# EAGLE design 2010_06_16_a_matriLedWatch (EAGLE 4.16)

## Sheet 1 of 2
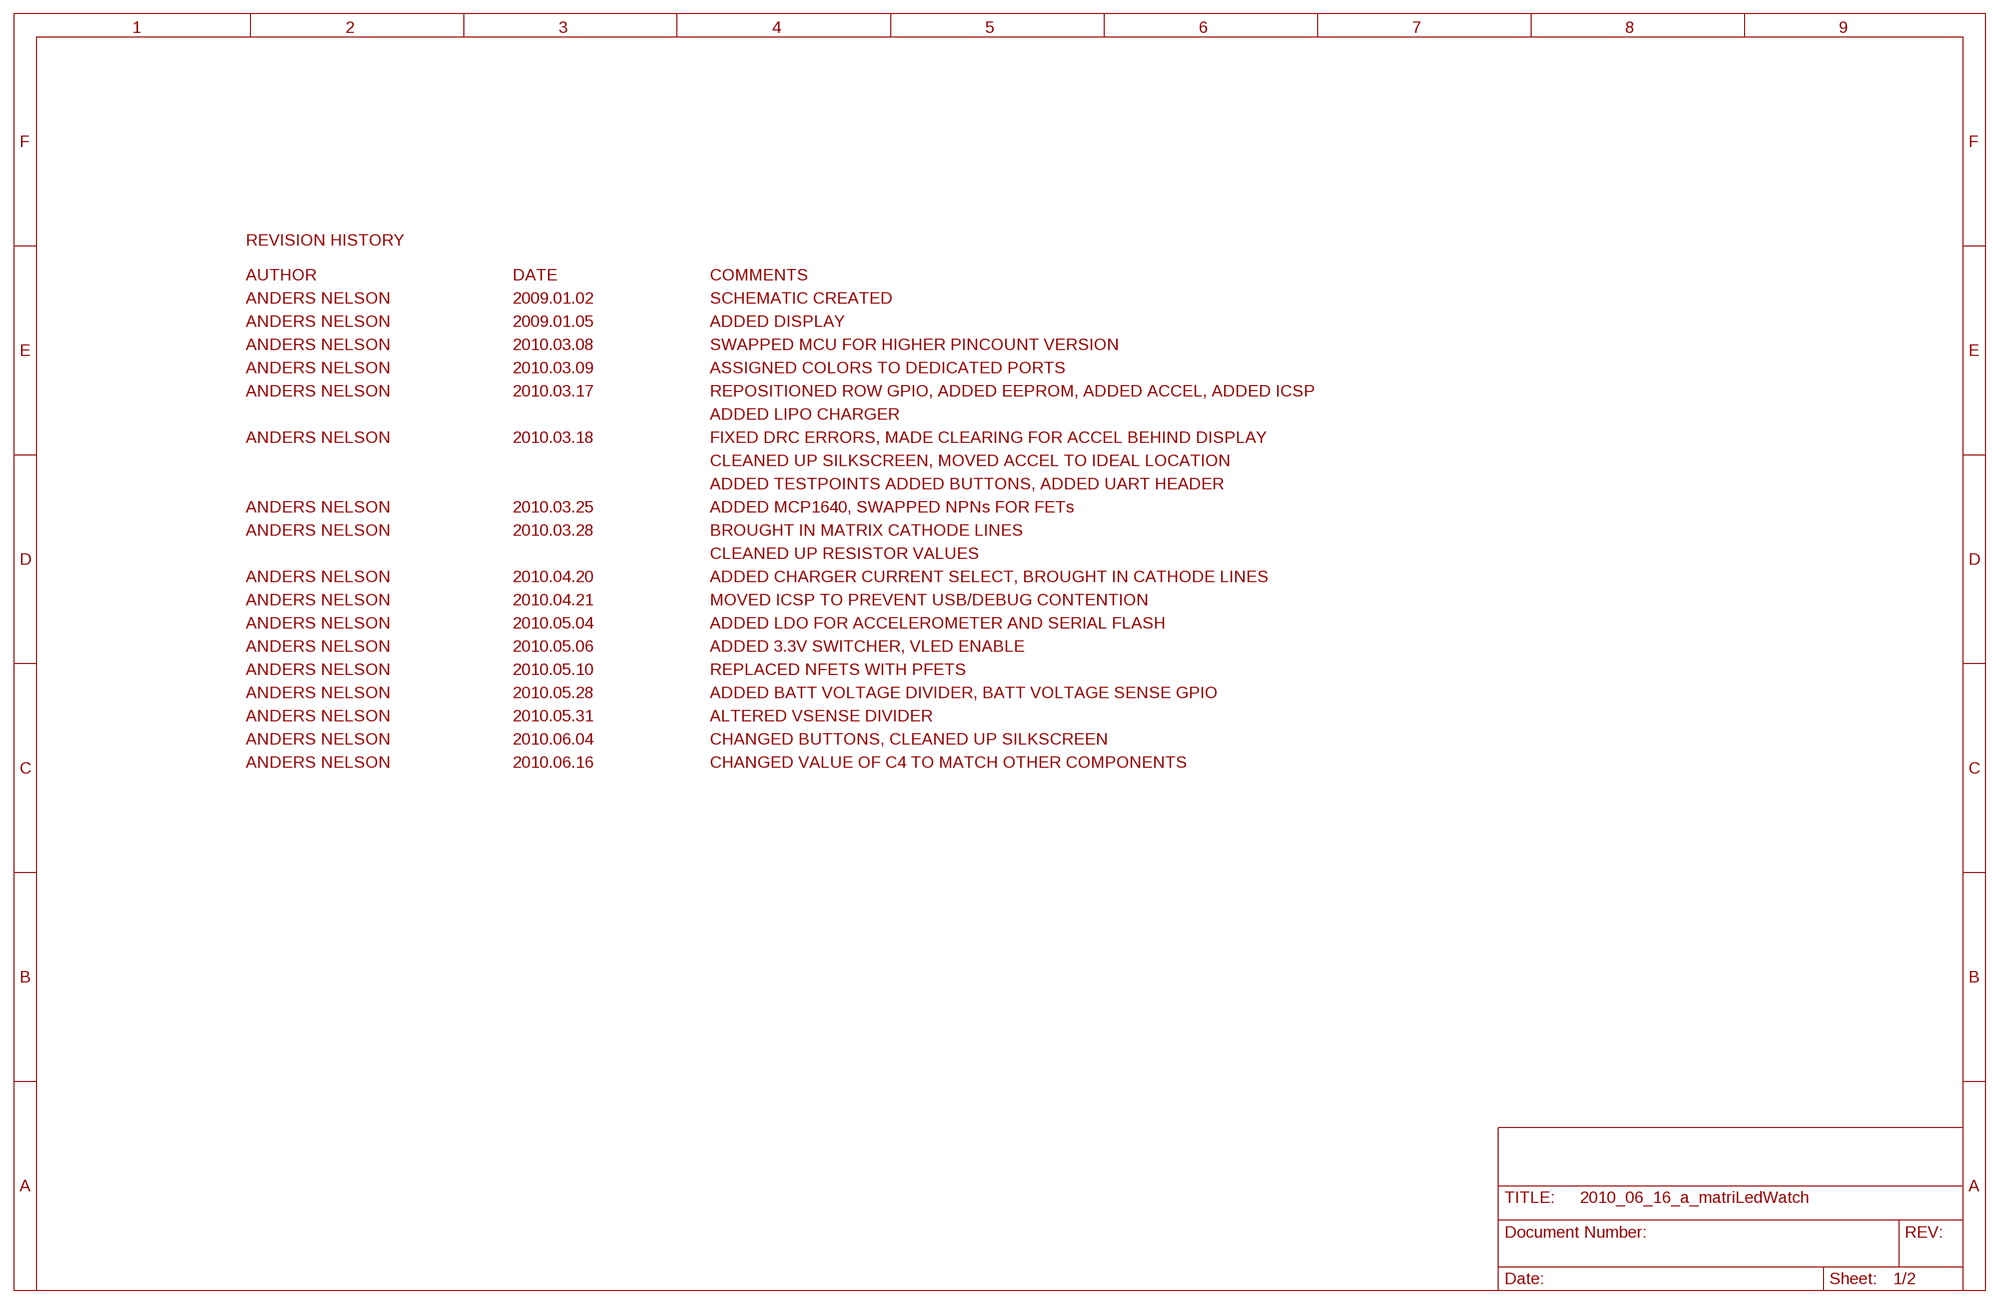
[diagram p0: schematic, sheet 1]

### Notes on the sheet
- REVISION HISTORY
- AUTHOR | DATE | COMMENTS
- ANDERS NELSON | 2009.01.02 | SCHEMATIC CREATED
- ANDERS NELSON | 2009.01.05 | ADDED DISPLAY
- ANDERS NELSON | 2010.03.08 | SWAPPED MCU FOR HIGHER PINCOUNT VERSION
- ANDERS NELSON | 2010.03.09 | ASSIGNED COLORS TO DEDICATED PORTS
- ANDERS NELSON | 2010.03.17 | REPOSITIONED ROW GPIO, ADDED EEPROM, ADDED ACCEL, ADDED ICSP
- ADDED LIPO CHARGER
- ANDERS NELSON | 2010.03.18 | FIXED DRC ERRORS, MADE CLEARING FOR ACCEL BEHIND DISPLAY
- CLEANED UP SILKSCREEN, MOVED ACCEL TO IDEAL LOCATION
- ADDED TESTPOINTS ADDED BUTTONS, ADDED UART HEADER
- ANDERS NELSON | 2010.03.25 | ADDED MCP1640, SWAPPED NPNs FOR FETs
- ANDERS NELSON | 2010.03.28 | BROUGHT IN MATRIX CATHODE LINES
- CLEANED UP RESISTOR VALUES
- ANDERS NELSON | 2010.04.20 | ADDED CHARGER CURRENT SELECT, BROUGHT IN CATHODE LINES
- ANDERS NELSON | 2010.04.21 | MOVED ICSP TO PREVENT USB/DEBUG CONTENTION
- ANDERS NELSON | 2010.05.04 | ADDED LDO FOR ACCELEROMETER AND SERIAL FLASH
- ANDERS NELSON | 2010.05.06 | ADDED 3.3V SWITCHER, VLED ENABLE
- ANDERS NELSON | 2010.05.10 | REPLACED NFETS WITH PFETS
- ANDERS NELSON | 2010.05.28 | ADDED BATT VOLTAGE DIVIDER, BATT VOLTAGE SENSE GPIO
- ANDERS NELSON | 2010.05.31 | ALTERED VSENSE DIVIDER
- ANDERS NELSON | 2010.06.04 | CHANGED BUTTONS, CLEANED UP SILKSCREEN
- ANDERS NELSON | 2010.06.16 | CHANGED VALUE OF C4 TO MATCH OTHER COMPONENTS

## Sheet 2 of 2
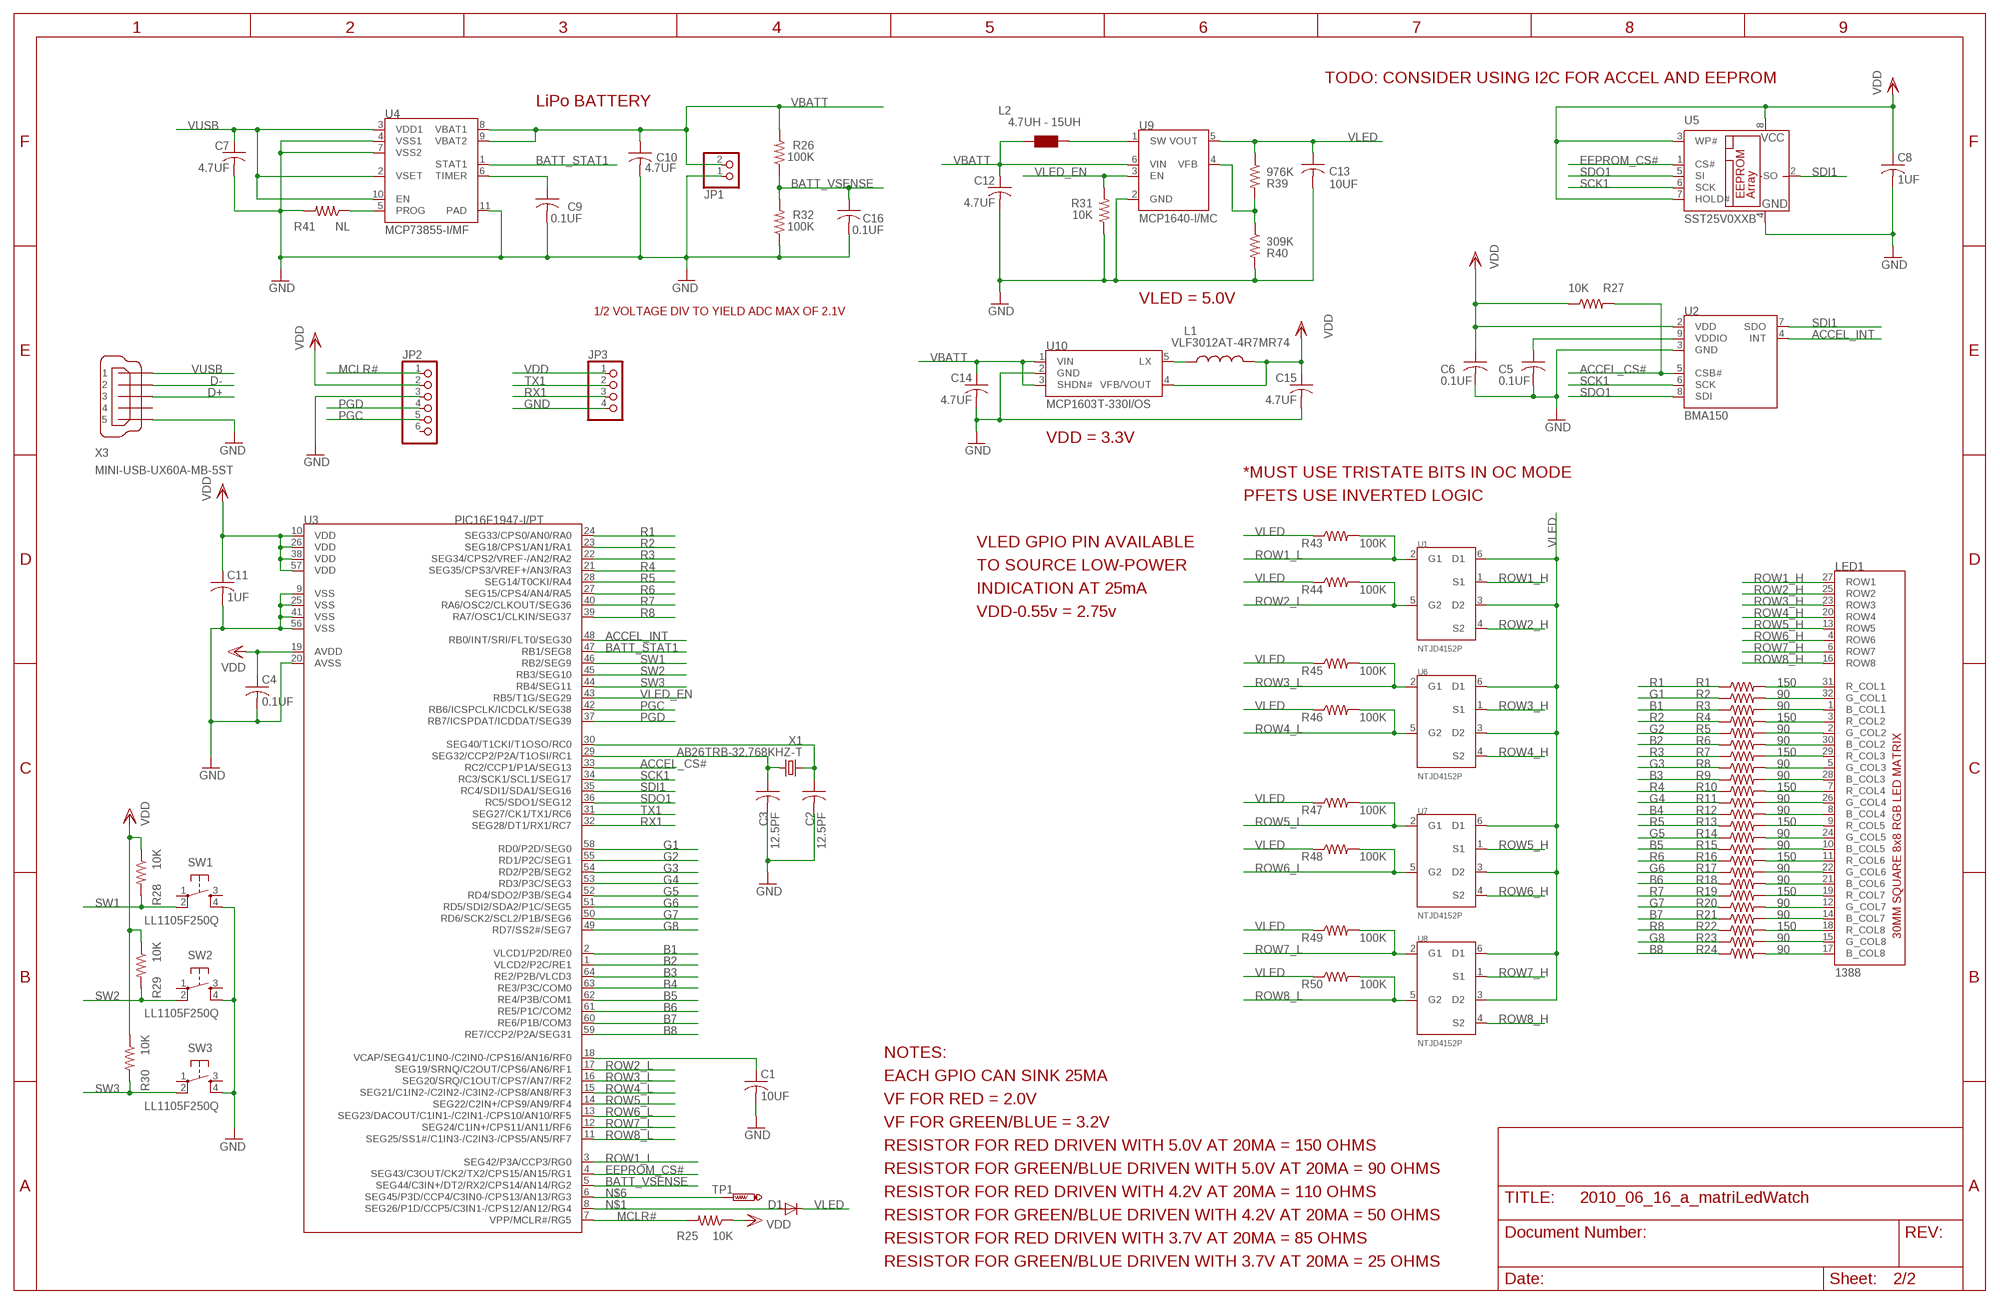
[diagram p1: schematic, sheet 2]

### Parts
C1  10UF  C-USC0603  [C0603]
C2  12.5PF  C-USC0603  [C0603]
C3  12.5PF  C-USC0603  [C0603]
C4  0.1UF  C-USC0603  [C0603]
C5  0.1UF  C-USC0603  [C0603]
C6  0.1UF  C-USC0603  [C0603]
C7  4.7UF  C-USC0603  [C0603]
C8  1UF  C-USC0603  [C0603]
C9  0.1UF  C-USC0603  [C0603]
C10  4.7UF  C-USC0603  [C0603]
C11  1UF  C-USC0603  [C0603]
C12  4.7UF  C-USC0603  [C0603]
C13  10UF  C-USC0603  [C0603]
C14  4.7UF  C-USC0603  [C0603]
C15  4.7UF  C-USC0603  [C0603]
C16  0.1UF  C-USC0603  [C0603]
D1  DIODE-SOD323-R  [SOD323-R]
JP1  PINHD-1X2  [1X02]
JP2  PINHD-1X6  [1X06]
JP3  PINHD-1X4  [1X04]
L1  VLF3012AT-4R7MR74  [VLF3012A]
L2  4.7UH - 15UH  WE-TPC_S  [WE-TPC_S]
LED1  1388  [1388]
R1  150  R-US_R0402  [R0402]
R2  90  R-US_R0402  [R0402]
R3  90  R-US_R0402  [R0402]
R4  150  R-US_R0402  [R0402]
R5  90  R-US_R0402  [R0402]
R6  90  R-US_R0402  [R0402]
R7  150  R-US_R0402  [R0402]
R8  90  R-US_R0402  [R0402]
R9  90  R-US_R0402  [R0402]
R10  150  R-US_R0402  [R0402]
R11  90  R-US_R0402  [R0402]
R12  90  R-US_R0402  [R0402]
R13  150  R-US_R0402  [R0402]
R14  90  R-US_R0402  [R0402]
R15  90  R-US_R0402  [R0402]
R16  150  R-US_R0402  [R0402]
R17  90  R-US_R0402  [R0402]
R18  90  R-US_R0402  [R0402]
R19  150  R-US_R0402  [R0402]
R20  90  R-US_R0402  [R0402]
R21  90  R-US_R0402  [R0402]
R22  150  R-US_R0402  [R0402]
R23  90  R-US_R0402  [R0402]
R24  90  R-US_R0402  [R0402]
R25  10K  R-US_R0603  [R0603]
R26  100K  R-US_R0603  [R0603]
R27  10K  R-US_R0603  [R0603]
R28  10K  R-US_R0603  [R0603]
R29  10K  R-US_R0603  [R0603]
R30  10K  R-US_R0603  [R0603]
R31  10K  R-US_R0603  [R0603]
R32  100K  R-US_R0603  [R0603]
R39  976K  R-US_R0603  [R0603]
R40  309K  R-US_R0603  [R0603]
R41  NL  R-US_R0603  [R0603]
R43  100K  R-US_R0402  [R0402]
R44  100K  R-US_R0402  [R0402]
R45  100K  R-US_R0402  [R0402]
R46  100K  R-US_R0402  [R0402]
R47  100K  R-US_R0402  [R0402]
R48  100K  R-US_R0402  [R0402]
R49  100K  R-US_R0402  [R0402]
R50  100K  R-US_R0402  [R0402]
SW1  LL1105F250Q  [LL1105]
SW2  LL1105F250Q  [LL1105]
SW3  LL1105F250Q  [LL1105]
TP1  PTR1B1,27  [B1,27]
U1  NTJD4152P  [SOT363_PHILIPS]
U2  BMA150  [LGA_3X3]
U3  PIC16F1947-I/PT  [TQFP64-10X10]
U4  MCP73855-I/MF  [DFN10_3X3MC]
U5  SST25V0XXB  [SO-08M]
U6  NTJD4152P  [SOT363_PHILIPS]
U7  NTJD4152P  [SOT363_PHILIPS]
U8  NTJD4152P  [SOT363_PHILIPS]
U9  MCP1640-I/MC  [SOT23-6L]
U10  MCP1603T-330I/OS  [SOT23-5L]
X1  AB26TRB-32.768KHZ-T  [CYL_6MM_2MM_SMD]
X3  MINI-USB-UX60A-MB-5ST  [UX60A-MB-5ST]

### Nets
ACCEL_CS#: R27.2 U2.5(CSB#) U3.33(RC2/CCP1/P1A/SEG13)
ACCEL_INT: U2.4(INT) U3.48(RB0/INT/SRI/FLT0/SEG30)
B1: R3.1 U3.2(VLCD1/P2D/RE0)
B2: R6.1 U3.1(VLCD2/P2C/RE1)
B3: R9.1 U3.64(RE2/P2B/VLCD3)
B4: R12.1 U3.63(RE3/P3C/COM0)
B5: R15.1 U3.62(RE4/P3B/COM1)
B6: R18.1 U3.61(RE5/P1C/COM2)
B7: R21.1 U3.60(RE6/P1B/COM3)
B8: R24.1 U3.59(RE7/CCP2/P2A/SEG31)
BATT_STAT1: U3.47(RB1/SEG8) U4.1(STAT1)
BATT_VSENSE: C16.1 R26.1 R32.2 U3.5(SEG44/C3IN+/DT2/RX2/CPS14/AN14/RG2)
D+: X3.3
D-: X3.2
EEPROM_CS#: U3.4(SEG43/C3OUT/CK2/TX2/CPS15/AN15/RG1) U5.1(CS#)
G1: R2.1 U3.58(RD0/P2D/SEG0)
G2: R5.1 U3.55(RD1/P2C/SEG1)
G3: R8.1 U3.54(RD2/P2B/SEG2)
G4: R11.1 U3.53(RD3/P3C/SEG3)
G5: R14.1 U3.52(RD4/SDO2/P3B/SEG4)
G6: R17.1 U3.51(RD5/SDI2/SDA2/P1C/SEG5)
G7: R20.1 U3.50(RD6/SCK2/SCL2/P1B/SEG6)
G8: R23.1 U3.49(RD7/SS2#/SEG7)
GND: C1.2 C2.2 C3.2 C4.2 C5.2 C6.2 C7.2 C8.2 C9.2 C10.2 C11.2 C12.2 C13.2 C14.2 C15.2 C16.2 JP1.1 JP2.3 JP3.4 R31.1 R32.1 R40.2 R41.2 SW1.4(S1) SW2.4(S1) SW3.4(S1) U2.3(GND) U3.9(VSS) U3.20(AVSS) U3.25(VSS) U3.41(VSS) U3.56(VSS) U4.4(VSS1) U4.7(VSS2) U4.11(PAD) U5.4(GND) U9.2(GND) U10.2(GND) X3.5
MCLR#: JP2.1 R25.2 U3.7(VPP/MCLR#/RG5)
N$1: D1.A U3.8(SEG26/P1D/CCP5/C3IN1-/CPS12/AN12/RG4)
N$2: L2.1 U9.1(SW)
N$3: R41.1 U4.5(PROG)
N$4: R39.2 R40.1 U9.4(VFB)
N$5: L1.P$1 U10.5(LX)
N$6: TP1.PP(TP) U3.6(SEG45/P3D/CCP4/C3IN0-/CPS13/AN13/RG3)
N$9: LED1.31(R_COL1) R1.2
N$10: LED1.32(G_COL1) R2.2
N$11: LED1.1(B_COL1) R3.2
N$12: LED1.3(R_COL2) R4.2
N$13: LED1.2(G_COL2) R5.2
N$14: LED1.30(B_COL2) R6.2
N$15: LED1.29(R_COL3) R7.2
N$16: LED1.5(G_COL3) R8.2
N$17: LED1.28(B_COL3) R9.2
N$18: LED1.7(R_COL4) R10.2
N$19: LED1.26(G_COL4) R11.2
N$20: LED1.8(B_COL4) R12.2
N$21: LED1.9(R_COL5) R13.2
N$22: LED1.24(G_COL5) R14.2
N$23: LED1.10(B_COL5) R15.2
N$24: LED1.11(R_COL6) R16.2
N$25: LED1.22(G_COL6) R17.2
N$26: LED1.21(B_COL6) R18.2
N$27: LED1.19(R_COL7) R19.2
N$28: LED1.12(G_COL7) R20.2
N$29: LED1.14(B_COL7) R21.2
N$30: LED1.18(R_COL8) R22.2
N$31: LED1.15(G_COL8) R23.2
N$32: LED1.17(B_COL8) R24.2
N$36: C9.1 U4.6(TIMER)
N$42: C5.1 U2.9(VDDIO)
N$65: C1.1 U3.18(VCAP/SEG41/C1IN0-/C2IN0-/CPS16/AN16/RF0)
N$67: C3.1 U3.29(SEG32/CCP2/P2A/T1OSI/RC1) X1.3
N$68: C2.1 U3.30(SEG40/T1CKI/T1OSO/RC0) X1.2
PGC: JP2.5 U3.42(RB6/ICSPCLK/ICDCLK/SEG38)
PGD: JP2.4 U3.37(RB7/ICSPDAT/ICDDAT/SEG39)
R1: R1.1 U3.24(SEG33/CPS0/AN0/RA0)
R2: R4.1 U3.23(SEG18/CPS1/AN1/RA1)
R3: R7.1 U3.22(SEG34/CPS2/VREF-/AN2/RA2)
R4: R10.1 U3.21(SEG35/CPS3/VREF+/AN3/RA3)
R5: R13.1 U3.28(SEG14/T0CKI/RA4)
R6: R16.1 U3.27(SEG15/CPS4/AN4/RA5)
R7: R19.1 U3.40(RA6/OSC2/CLKOUT/SEG36)
R8: R22.1 U3.39(RA7/OSC1/CLKIN/SEG37)
ROW1_H: LED1.27(ROW1) U1.1(S1)
ROW1_L: R43.2 U1.2(G1) U3.3(SEG42/P3A/CCP3/RG0)
ROW2_H: LED1.25(ROW2) U1.4(S2)
ROW2_L: R44.2 U1.5(G2) U3.17(SEG19/SRNQ/C2OUT/CPS6/AN6/RF1)
ROW3_H: LED1.23(ROW3) U6.1(S1)
ROW3_L: R45.2 U3.16(SEG20/SRQ/C1OUT/CPS7/AN7/RF2) U6.2(G1)
ROW4_H: LED1.20(ROW4) U6.4(S2)
ROW4_L: R46.2 U3.15(SEG21/C1IN2-/C2IN2-/C3IN2-/CPS8/AN8/RF3) U6.5(G2)
ROW5_H: LED1.13(ROW5) U7.1(S1)
ROW5_L: R47.2 U3.14(SEG22/C2IN+/CPS9/AN9/RF4) U7.2(G1)
ROW6_H: LED1.4(ROW6) U7.4(S2)
ROW6_L: R48.2 U3.13(SEG23/DACOUT/C1IN1-/C2IN1-/CPS10/AN10/RF5) U7.5(G2)
ROW7_H: LED1.6(ROW7) U8.1(S1)
ROW7_L: R49.2 U3.12(SEG24/C1IN+/CPS11/AN11/RF6) U8.2(G1)
ROW8_H: LED1.16(ROW8) U8.4(S2)
ROW8_L: R50.2 U3.11(SEG25/SS1#/C1IN3-/C2IN3-/CPS5/AN5/RF7) U8.5(G2)
RX1: JP3.3 U3.32(SEG28/DT1/RX1/RC7)
SCK1: U2.6(SCK) U3.34(RC3/SCK1/SCL1/SEG17) U5.6(SCK)
SDI1: U2.7(SDO) U3.35(RC4/SDI1/SDA1/SEG16) U5.2(SO)
SDO1: U2.8(SDI) U3.36(RC5/SDO1/SEG12) U5.5(SI)
SW1: R28.2 SW1.2(P1) U3.46(RB2/SEG9)
SW2: R29.2 SW2.2(P1) U3.45(RB3/SEG10)
SW3: R30.2 SW3.2(P1) U3.44(RB4/SEG11)
TX1: JP3.2 U3.31(SEG27/CK1/TX1/RC6)
VBATT: C10.1 C12.1 C14.1 JP1.2 L2.2 R26.2 U4.8(VBAT1) U4.9(VBAT2) U9.6(VIN) U10.1(VIN) U10.3(SHDN#)
VDD: C4.1 C6.1 C8.1 C11.1 C15.1 JP2.2 JP3.1 L1.P$2 R25.1 R27.1 R28.1 R29.1 R30.1 U2.2(VDD) U3.10(VDD) U3.19(AVDD) U3.26(VDD) U3.38(VDD) U3.57(VDD) U5.3(WP#) U5.7(HOLD#) U5.8(VCC) U10.4(VFB/VOUT)
VLED: C13.1 D1.C R39.1 R43.1 R44.1 R45.1 R46.1 R47.1 R48.1 R49.1 R50.1 U1.3(D2) U1.6(D1) U6.3(D2) U6.6(D1) U7.3(D2) U7.6(D1) U8.3(D2) U8.6(D1) U9.5(VOUT)
VLED_EN: R31.2 U3.43(RB5/T1G/SEG29) U9.3(EN)
VUSB: C7.1 U4.2(VSET) U4.3(VDD1) U4.10(EN) X3.1
Unconnected: JP2.6 SW1.1(P) SW1.3(S) SW2.1(P) SW2.3(S) SW3.1(P) SW3.3(S) X3.4

### Notes on the sheet
- TODO: CONSIDER USING I2C FOR ACCEL AND EEPROM
- LiPo BATTERY
- VLED = 5.0V
- 1/2 VOLTAGE DIV TO YIELD ADC MAX OF 2.1V
- VDD = 3.3V
- *MUST USE TRISTATE BITS IN OC MODE
- PFETS USE INVERTED LOGIC
- VLED GPIO PIN AVAILABLE
- TO SOURCE LOW-POWER
- INDICATION AT 25mA
- VDD-0.55v = 2.75v
- NOTES:
- EACH GPIO CAN SINK 25MA
- VF FOR RED = 2.0V
- VF FOR GREEN/BLUE = 3.2V
- RESISTOR FOR RED DRIVEN WITH 5.0V AT 20MA = 150 OHMS
- RESISTOR FOR GREEN/BLUE DRIVEN WITH 5.0V AT 20MA = 90 OHMS
- RESISTOR FOR RED DRIVEN WITH 4.2V AT 20MA = 110 OHMS
- RESISTOR FOR GREEN/BLUE DRIVEN WITH 4.2V AT 20MA = 50 OHMS
- RESISTOR FOR RED DRIVEN WITH 3.7V AT 20MA = 85 OHMS
- RESISTOR FOR GREEN/BLUE DRIVEN WITH 3.7V AT 20MA = 25 OHMS

## Library data of the parts
C1-C16 = rcl:C-US: CAPACITOR, American symbol
D1 = diode:DIODE-: DIODE
JP1 = pinhead:PINHD-1X2: PIN HEADER
JP2 = pinhead:PINHD-1X6: PIN HEADER
JP3 = pinhead:PINHD-1X4: PIN HEADER
L1 = matriLedWatch:VLF3012AT*
L2 = wuerth-elektronik:WE-TPC: Shielded Tiny Power Inductor WE-TPC - Extremely flat power inductor - High current capability - High reliability and perfect soldering characteristics because of integrated soldering pad - magnetically shielded -- Portable power like PDA, digital camera, PCMICA-cards and displays -- DC/DC-converter -- Recommended for switching regulator IC's from Linear Technology, National Semiconductor, Texas Instruments and Fairchild Semiconductor
LED1 = matriLedWatch:1388
R1-R32 R39-R41 R43-R50 = rcl:R-US_: RESISTOR, American symbol
SW1-SW3 = raveGearControl:LL1105*
TP1 = testpad:PTR1: TEST PIN
U1 U6-U8 = matriLedWatch:NTJD4152P
U2 = Bosch:BMA150
U3 = matriLedWatch:PIC16F194*
U4 = matriLedWatch:MCP73855
U5 = raveGearControl:SST25V0XXB
U9 = matriLedWatch:MCP1640*
U10 = matriLedWatch:MCP1603*
X1 = raveGearControl2:AB26TRB-32.768KHZ-T
X3 = con-hirose:MINI-USB-: MINI USB Connector Source: http://www.hirose.co.jp/cataloge_hp/e24000019.pdf

## Board
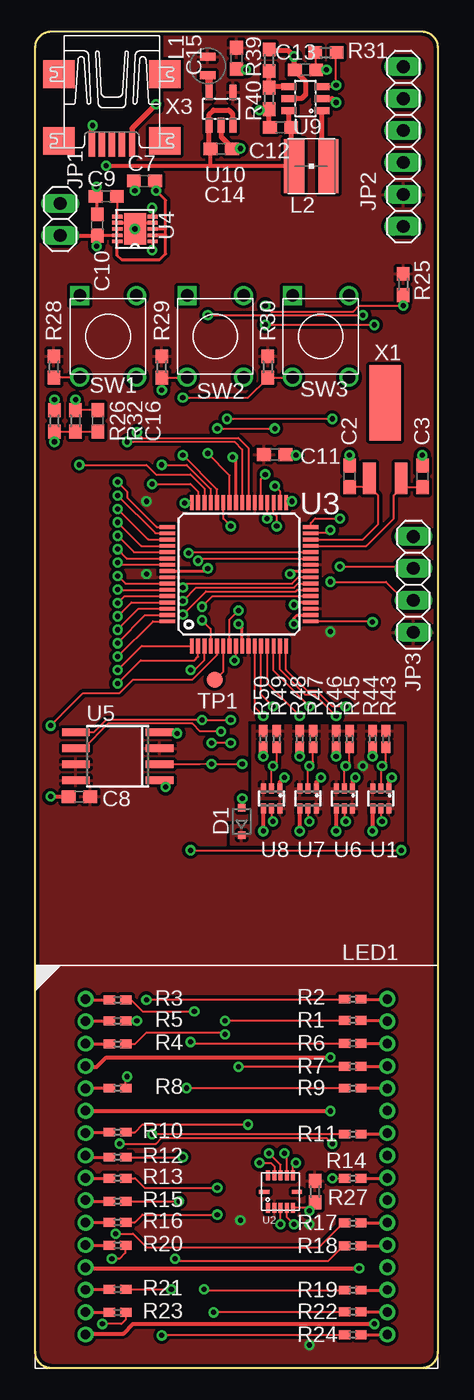
[diagram p2: board, top side]
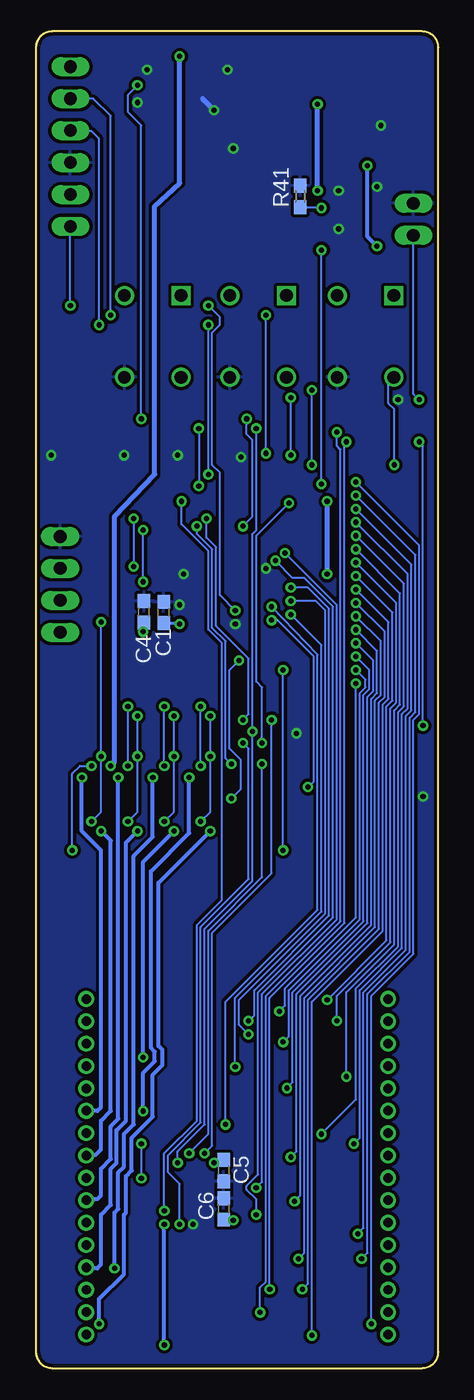
[diagram p3: board, bottom side, seen from below]

Size 32 x 106.22 mm. Coordinates in mm from the lower left corner, seen from the top.
Outline: 1.27,0 arc-90 0,1.27 0,104.95 arc-90 1.27,106.22 30.73,106.22 arc-90 32,104.95 32,1.27 arc-90 30.73,0 1.27,0
Copper layers (1*16): Top 0.0356mm / dielectric 0.2007mm / Bottom 0.0356mm
Design rules "PCBExpress_E2": minimum track width 6mil, minimum drill 16mil, track to track 6mil, track to pad 6mil, pad to pad 6mil, via to via 6mil, smd to smd 0mil, copper to edge 10mil, drill to drill 8mil, minimum pad ring 10mil, minimum via ring 8mil, stop-mask expansion 4mil, vias tented up to drill 16mil, thermal gap 10mil

### Footprints (pad centres in the part's own frame; a part is rotated, then mirrored left to right if it is on the bottom)
C0603 = smd 1.1 x 1: 1 -0.85,0; 2 0.85,0
SOD323-R = smd 0.6 x 0.6: A 1.1,0; C -1.1,0
1X02 = drill 1.016 long: 1 -1.27,0; 2 1.27,0
1X06 = drill 1.016 long: 1 -6.35,0; 2 -3.81,0; 3 -1.27,0; 4 1.27,0; 5 3.81,0; 6 6.35,0
1X04 = drill 1.016 long: 1 -3.81,0; 2 -1.27,0; 3 1.27,0; 4 3.81,0
VLF3012A = smd 0.65 x 1.2: P$1 -0.725,0; P$2 0.725,0
WE-TPC_S = smd 1.6 x 4.3: 1 -1.356,-0.014; 2 1.356,-0.014
1388 = drill 0.75 round: 1 -12,13.335; 2 -12,11.557; 3 -12,9.779; 4 -12,8.001; 5 -12,6.223; 6 -12,4.445; 7 -12,2.667; 8 -12,0.889; 9 -12,-0.889; 10 -12,-2.667; 11 -12,-4.445; 12 -12,-6.223; 13 -12,-8.001; 14 -12,-9.779; 15 -12,-11.557; 16 -12,-13.335; 17 12,-13.335; 18 12,-11.557; 19 12,-9.779; 20 12,-8.001; 21 12,-6.223; 22 12,-4.445; 23 12,-2.667; 24 12,-0.889; 25 12,0.889; 26 12,2.667; 27 12,4.445; 28 12,6.223; 29 12,8.001; 30 12,9.779; 31 12,11.557; 32 12,13.335
R0402 = smd 0.9 x 0.7: 1 -0.65,0; 2 0.65,0
R0603 = smd 1.1 x 1: 1 -0.85,0; 2 0.85,0
LL1105 = drill 1 square: 1 -3.25,-2.25 | drill 1 round: 2 3.25,-2.25; 3 -3.25,2.25; 4 3.25,2.25
B1,27 = smd 1.27 x 1.27: PP 0,0
SOT363_PHILIPS = smd 0.4 x 0.8: 1 -0.65,-0.8; 2 0,-0.8; 3 0.65,-0.8; 4 0.65,0.8; 5 0,0.8; 6 -0.65,0.8
LGA_3X3 = smd 0.8 x 0.32: 1 -1.299,1.001; 2 -1.299,0.501; 3 -1.299,0.001; 4 -1.299,-0.499; 5 -1.299,-0.999; 6 1.301,-0.999; 7 1.301,-0.499; 8 1.301,0.001; 9 1.301,0.501; 10 1.301,1.001 | smd 0.32 x 0.8: 11 0.001,1.301; 12 0.001,-1.299
TQFP64-10X10 = smd 1.2 x 0.3: 1 -5.7,3.75; 2 -5.7,3.25; 3 -5.7,2.75; 4 -5.7,2.25; 5 -5.7,1.75; 6 -5.7,1.25; 7 -5.7,0.75; 8 -5.7,0.25; 9 -5.7,-0.25; 10 -5.7,-0.75; 11 -5.7,-1.25; 12 -5.7,-1.75; 13 -5.7,-2.25; 14 -5.7,-2.75; 15 -5.7,-3.25; 16 -5.7,-3.75; 33 5.7,-3.75; 34 5.7,-3.25; 35 5.7,-2.75; 36 5.7,-2.25; 37 5.7,-1.75; 38 5.7,-1.25; 39 5.7,-0.75; 40 5.7,-0.25; 41 5.7,0.25; 42 5.7,0.75; 43 5.7,1.25; 44 5.7,1.75; 45 5.7,2.25; 46 5.7,2.75; 47 5.7,3.25; 48 5.7,3.75 | smd 0.3 x 1.2: 17 -3.75,-5.7; 18 -3.25,-5.7; 19 -2.75,-5.7; 20 -2.25,-5.7; 21 -1.75,-5.7; 22 -1.25,-5.7; 23 -0.75,-5.7; 24 -0.25,-5.7; 25 0.25,-5.7; 26 0.75,-5.7; 27 1.25,-5.7; 28 1.75,-5.7; 29 2.25,-5.7; 30 2.75,-5.7; 31 3.25,-5.7; 32 3.75,-5.7; 49 3.75,5.7; 50 3.25,5.7; 51 2.75,5.7; 52 2.25,5.7; 53 1.75,5.7; 54 1.25,5.7; 55 0.75,5.7; 56 0.25,5.7; 57 -0.25,5.7; 58 -0.75,5.7; 59 -1.25,5.7; 60 -1.75,5.7; 61 -2.25,5.7; 62 -2.75,5.7; 63 -3.25,5.7; 64 -3.75,5.7
DFN10_3X3MC = smd 0.813 x 0.305: 1 -1.397,0.991; 2 -1.397,0.508; 3 -1.397,0; 4 -1.397,-0.508; 5 -1.397,-0.991; 6 1.397,-0.991; 7 1.397,-0.508; 8 1.397,0; 9 1.397,0.508; 10 1.397,0.991 | smd 1.753 x 2.489: 11 0,0
SO-08M = smd 0.6 x 2.2: 1 -1.905,-3.33; 2 -0.635,-3.33; 3 0.635,-3.33; 4 1.905,-3.33; 5 1.905,3.33; 6 0.635,3.33; 7 -0.635,3.33; 8 -1.905,3.33
SOT23-6L = smd 0.55 x 1.2: 1 -0.95,-1.3; 2 0,-1.3; 3 0.95,-1.3; 4 0.95,1.3; 5 0,1.3; 6 -0.95,1.3
SOT23-5L = smd 0.55 x 1.2: 1 -0.95,-1.3; 2 0,-1.3; 3 0.95,-1.3; 4 0.95,1.3; 5 -0.95,1.3
CYL_6MM_2MM_SMD = smd 6 x 2.5: 1 -2.125,0 | smd 2.5 x 1: 2 3.875,-1.27; 3 3.875,1.27
UX60A-MB-5ST = smd 2 x 0.5: 1 2.25,1.6; 2 2.25,0.8; 3 2.25,0; 4 2.25,-0.8; 5 2.25,-1.6 | smd 2.2 x 2.5: M1 -3.3,-4.2; M2 -3.3,4.2; M3 2,4.2; M4 2,-4.2

### Placement (x,y rotation side)
C1  21.84,60.05 90 bottom
C2  24.99,70.87 90 top
C3  30.78,70.87 90 top
C4  23.42,60.1 90 bottom
C5  17.07,15.7 270 bottom
C6  17.07,12.65 90 bottom
C7  8.69,94.34 180 top
C8  3.51,45.42 180 top
C9  5.64,93.12 180 top
C10  4.93,90.83 90 top
C11  19.05,72.59 0 top
C12  19.51,98.6 180 top
C13  21.49,103.17 0 top
C14  14.78,96.88 0 top
C15  16,104.09 270 top
C16  4.98,75.29 90 top
D1  16.41,43.43 90 top
JP1  1.98,91.29 270 top
JP2  29.26,97.08 90 top
JP3  30.07,62.28 90 top
L1  13.72,103.48 90 top
L2  21.95,95.5 180 top
LED1  16,16 0 top
R1  25.25,27.64 0 top
R2  25.25,29.31 0 top
R3  6.55,29.26 180 top
R4  6.55,25.76 180 top
R5  6.55,27.58 180 top
R6  25.25,25.81 0 top
R7  25.25,23.98 0 top
R8  6.55,22.25 180 top
R9  25.25,22.25 0 top
R10  6.55,18.75 180 top
R11  25.25,18.59 0 top
R12  6.55,16.76 180 top
R13  6.55,15.09 180 top
R14  25.25,15.09 0 top
R15  6.55,13.26 180 top
R16  6.55,11.58 180 top
R17  25.25,11.53 0 top
R18  25.25,9.7 0 top
R19  25.25,6.2 0 top
R20  6.55,9.75 180 top
R21  6.55,6.25 180 top
R22  25.25,4.47 0 top
R23  6.55,4.42 180 top
R24  25.25,2.64 0 top
R25  29.26,86.11 270 top
R26  1.52,75.29 90 top
R27  22.25,14.02 270 top
R28  1.47,79.55 270 top
R29  10.06,79.55 270 top
R30  18.49,79.55 270 top
R31  23.11,104.55 0 top
R32  3.2,75.29 270 top
R39  18.59,103.94 270 top
R40  18.59,100.89 270 top
R41  10.97,93.12 90 bottom
R43  27.89,49.99 270 top
R44  26.82,49.99 270 top
R45  24.99,49.99 270 top
R46  23.93,49.99 270 top
R47  22.1,49.99 270 top
R48  21.03,49.99 270 top
R49  19.2,49.99 270 top
R50  18.14,49.99 270 top
SW1  5.79,81.99 270 top
SW2  14.33,81.99 270 top
SW3  22.71,81.99 270 top
TP1  14.27,54.71 0 top
U1  27.48,45.26 180 top
U2  19.51,14.02 90 top
U3  16.21,63.09 90 top
U4  7.92,90.53 180 top
U5  6.55,48.62 90 top
U6  24.59,45.26 180 top
U7  21.69,45.26 180 top
U8  18.8,45.26 180 top
U9  21.49,100.89 90 top
U10  14.78,100.08 0 top
X1  27.84,74.57 270 top
X3  6.1,99.52 270 top

### Tracks (layer width: path | path; a pad name or v marks a point on that pad's centre or on a via)
ACCEL_CS#  (via drill 0.41)
  Top 0.152: U2.5 21.87,12.72 22.25,13.11 | 22.25,13.11 R27.2 | v21.79,12.5 22.25,13.11 | U3.33 20.33,68.79 v20.42,68.89
  Bottom 0.152: v20.42,68.89 20.42,67.06 18.29,64.92 18.29,58.67 17.22,57.61 17.22,37.19 19.2,35.2 19.2,19.66 21.79,17.07 v21.79,12.5
ACCEL_INT  (via drill 0.41)
  Top 0.152: U3.48 11.95,68.79 v11.89,68.73 | U2.4 20.01,12 v20.57,11.43 | v15.54,49.68 v14.02,49.68
  Bottom 0.152: v20.57,11.43 20.57,14.63 21.49,15.54 21.49,16.92 18.9,19.51 18.9,35.05 15.09,38.86 15.09,49.23 v15.54,49.68 | v11.89,68.73 14.48,66.14 14.48,54.56 14.02,54.1 v14.02,49.68
B1  (via drill 0.41)
  Top 0.152: U3.2 12.96,56.54 12.65,56.24 8.38,56.24 v6.55,54.41 | R3.1 7.62,29.26 8.53,28.35 v12.65,28.35
  Bottom 0.152: v6.55,54.41 6.55,35.81 12.19,30.18 12.19,28.8 v12.65,28.35
B2  (via drill 0.41)
  Top 0.152: U3.1 8.47,57.39 v6.55,55.47 | R6.1 12.45,25.81 v12.34,25.91
  Bottom 0.152: v6.55,55.47 5.79,54.71 5.79,54.1 6.25,53.65 6.25,35.66 11.89,30.02 11.89,26.36 v12.34,25.91
B3  (via drill 0.41)
  Top 0.152: v12.04,22.25 R9.1 | U3.64 9.36,59.34 v6.55,56.54
  Bottom 0.152: v6.55,56.54 5.49,55.47 5.49,53.95 5.94,53.49 5.94,35.51 11.58,29.87 11.58,22.71 v12.04,22.25
B4  (via drill 0.41)
  Top 0.152: 10.47,59.84 U3.63 8.74,59.84 v6.55,57.61 | R12.1 v11.73,16.76
  Bottom 0.152: v6.55,57.61 5.18,56.24 5.18,53.8 5.64,53.34 5.64,35.36 11.28,29.72 11.28,17.22 v11.73,16.76
B5  (via drill 0.41)
  Top 0.152: U3.62 8.22,60.34 v6.55,58.67 | R15.1 v11.43,13.26
  Bottom 0.152: v6.55,58.67 4.88,57 4.88,53.65 5.33,53.19 5.33,35.2 10.97,29.57 10.97,13.72 v11.43,13.26
B6  (via drill 0.41)
  Top 0.152: U3.61 7.66,60.84 v6.55,59.74 | R18.1 24.49,9.7 23.32,8.53 11.28,8.53 v11.12,8.69
  Bottom 0.152: v11.12,8.69 10.67,9.14 10.67,29.41 5.03,35.05 5.03,53.03 4.57,53.49 4.57,57.76 v6.55,59.74
B7  (via drill 0.41)
  Top 0.152: U3.60 7.09,61.34 v6.55,60.81 | R21.1 v10.82,6.25
  Bottom 0.152: v10.82,6.25 10.36,6.71 10.36,29.26 4.72,34.9 4.72,52.88 4.27,53.34 4.27,58.52 v6.55,60.81
B8  (via drill 0.41)
  Top 0.152: U3.59 6.52,61.84 v6.55,61.87 | R24.1 10.11,2.64 v10.06,2.59
  Bottom 0.152: v10.06,2.59 10.06,29.11 4.42,34.75 4.42,52.73 3.96,53.19 3.96,59.28 v6.55,61.87
BATT_STAT1  (via drill 0.41)
  Top 0.152: U4.1 9.32,88.88 v9.3,88.85 | U3.47 12.96,69.65 12.34,70.26 v9.3,70.26
  Bottom 0.152: v9.3,70.26 v9.3,88.85
BATT_VSENSE  (via drill 0.41)
  Top 0.152: U3.5 14.46,56.67 12.5,54.71 7.77,54.71 6.71,53.65 3.81,53.65 v1.22,51.05 | v1.52,73.61 R26.1 R32.2 4.94,74.44 4.98,74.47 | 4.98,74.47 5.03,74.52 | 4.98,74.47 C16.1
  Bottom 0.152: v1.22,51.05 1.22,73.3 v1.52,73.61
EEPROM_CS#  (via drill 0.41)
  Top 0.152: U3.4 13.96,58.74 v13.26,59.44 | U5.1 9.88,46.66 v10.36,46.18
  Bottom 0.152: v13.26,59.44 12.8,59.44 9.91,56.54 9.91,46.63 v10.36,46.18
G1  (via drill 0.41)
  Top 0.152: U3.58 7.17,62.34 v6.55,62.94 | R2.1 8.89,29.31 v8.84,29.26
  Bottom 0.152: v8.84,29.26 4.12,33.98 4.12,52.58 3.66,53.03 3.66,60.05 v6.55,62.94
G2  (via drill 0.41)
  Top 0.152: U3.55 6.69,63.84 v6.55,64.01 | R5.1 v8.08,27.58
  Bottom 0.152: v8.08,27.58 8.08,29.57 3.81,33.83 3.81,52.43 3.35,52.88 3.35,60.81 v6.55,64.01
G3  (via drill 0.41)
  Top 0.152: U3.54 7.28,64.34 v6.55,65.08 | R8.1 7.2,23.05 v7.32,23.16
  Bottom 0.152: v7.32,23.16 7.32,29.87 3.5,33.68 3.5,52.27 3.05,52.73 3.05,61.57 v6.55,65.08
G4  (via drill 0.41)
  Top 0.152: U3.53 7.85,64.84 v6.55,66.14 | v9.3,18.59 R11.1
  Bottom 0.152: v9.3,18.59 6.55,21.34 6.55,30.18 3.2,33.53 3.2,52.12 2.74,52.58 2.74,62.33 v6.55,66.14
G5  (via drill 0.41)
  Top 0.152: v23.62,15.09 R14.1 | v6.71,17.83 9.6,17.83 10.06,18.29 23.16,18.29 v23.62,17.83 | U3.52 8.42,65.34 v6.55,67.21
  Bottom 0.152: v6.71,17.83 6.25,18.29 6.25,30.02 2.9,33.38 2.9,51.97 2.44,52.43 2.44,63.09 v6.55,67.21 | v23.62,17.83 v23.62,15.09
G6  (via drill 0.41)
  Top 0.152: R17.1 24.49,11.53 22.55,9.6 8.84,9.6 7.77,10.67 v6.4,10.67 | U3.51 8.98,65.84 v6.55,68.28
  Bottom 0.152: v6.4,10.67 5.94,11.12 5.94,29.87 2.59,33.22 2.59,51.82 2.13,52.27 2.13,63.86 v6.55,68.28
G7  (via drill 0.41)
  Top 0.152: v6.1,8.69 6.71,8.69 7.16,9.14 7.16,9.75 R20.1 | U3.50 9.55,66.34 v6.55,69.34
  Bottom 0.152: v6.1,8.69 5.64,9.14 5.64,29.72 2.29,33.07 2.29,51.66 1.83,52.12 1.83,64.62 v6.55,69.34
G8  (via drill 0.41)
  Top 0.152: U3.49 9.66,66.84 7.32,69.19 7.32,69.65 v6.55,70.41 | R23.1 7.2,3.85 6.86,3.5 v5.33,3.5
  Bottom 0.152: v5.33,3.5 5.33,29.57 1.98,32.92 1.98,51.51 1.52,51.97 1.52,65.38 v6.55,70.41
GND  (via drill 0.41)
  Top 0.152: U2.3 v19.51,11.43 | R31.1 22.34,104.46 C13.2 | C2.2 v24.99,72.54 | C3.2 v30.79,72.54 | v3.2,76.96 R32.1 4.96,76.14 C16.2 | C16.2 5.03,76.2 | C16.2
  Top 0.254: U4.4 8.59,91.03 8.53,90.98 8.53,91.44 8.61,91.52 8.61,91.21 U4.11 7.42,91.03 U4.7 | C10.2 4.93,92.91 4.72,93.12 C9.2 4.79,93.79 v4.88,93.88 | U3.56 13.51,63.34 v13.72,63.55 | U3.41 15.96,72.13 v15.7,72.39 | U3.25 20.52,63.34 v20.27,63.09 | U3.9 16.45,58.83 v16.15,59.13 | U3.20 20.76,60.84 v20.57,60.66
  Top 0.305: v1.22,45.41 C8.2 | U5.4 11.2,50.52 v11.28,50.44
  Top 0.406: X3.5 4.5,98.68 v4.57,98.75 | C7.2 7.84,93.64 v7.92,93.57 | C11.2 20.68,72.59 v20.73,72.54 | C13.2 v23.16,103.17 | C12.2 18.59,98.6 R40.2 17.89,100.04 v17.83,99.97 | 15.65,96.88 15.7,96.93 14.78,97.84 U10.2 | 15.65,96.88 C14.2 | U9.2 23.62,100.89 v23.93,100.58 | 15.65,96.88 16.2,96.88 v16.31,96.93
  Top 0.61: C15.2 16.7,103.24 v16.76,103.17
  Bottom 0.406: v17.83,99.97 18.75,100.89
  other vias: 7.92,90.53
  pour Bottom (isolate 0.254): 1.27,0 arc-90 0,1.27 0,104.95 arc-90 1.27,106.22 30.73,106.22 arc-90 32,104.95 32,1.27 arc-90 30.73,0
MCLR#  (via drill 0.41)
  Top 0.152: U3.7 15.46,59.5 v16.15,60.2 | v18.29,84.43 18.75,83.97 25.3,83.97 25.76,84.43 v29.26,84.43 R25.2
  Bottom 0.152: v16.15,60.2 17.37,61.42 17.37,71.17 17.98,71.78 17.98,82.3 17.37,82.91 17.37,83.52 v18.29,84.43 | v29.26,84.43 JP2.1
N$1  (via drill 0.41)
  Top 0.152: U3.8 15.96,56.34 v15.85,56.24 | D1.A 16.41,45.21 v16.46,45.26
  Bottom 0.152: v15.85,56.24 16.61,55.47 16.61,49.23 15.7,48.31 15.7,46.02 v16.46,45.26
N$2
  Top 0.406: L2.1 23.3,95.54 23.32,95.56 22.79,96.08 U9.1
N$3  (via drill 0.41)
  Top 0.152: U4.5 9.32,92.18 v9.3,92.2
  Bottom 0.152: R41.1 10.97,92.2 v9.3,92.2
N$4
  Top 0.406: U9.4 18.78,101.84 18.59,101.65 R40.1 R39.2
N$5
  Top 0.61: L1.P$1 13.72,102.72 13.83,102.53 U10.5
N$6
  Top 0.152: TP1.PP 14.33,54.71 14.96,55.34 U3.6
N$9
  Top 0.254: LED1.31 28.01,27.56 28.04,27.58 27.99,27.64 R1.2
N$10
  Top 0.254: 28,29.37 28.04,29.41 | 28,29.37 LED1.32 | R2.2 27.94,29.31 28,29.37
N$11
  Top 0.254: 4,29.38 3.96,29.41 | LED1.1 4,29.38 | R3.2 4.12,29.26 4,29.38
N$12
  Top 0.254: LED1.3 3.99,25.78 3.96,25.76 R4.2
N$13
  Top 0.254: LED1.2 3.96,27.58 R5.2
N$14
  Top 0.254: 28.02,25.78 28.04,25.76 | 28.02,25.78 LED1.30 | R6.2 27.99,25.81 28.02,25.78
N$15
  Top 0.254: 28,23.97 28.04,23.93 | 28,23.97 LED1.29 | R7.2 27.99,23.98 28,23.97
N$16
  Top 0.254: LED1.5 3.96,22.25 R8.2
N$17
  Top 0.254: 28,22.14 28.04,22.1 | 28,22.14 LED1.28 | R9.2 27.89,22.25 28,22.14
N$18
  Top 0.254: 4,18.63 3.96,18.59 | LED1.7 4,18.63 | R10.2 4.12,18.75 4,18.63
N$19
  Top 0.254: LED1.26 28,18.63 28.04,18.59 R11.2
N$20
  Top 0.254: LED1.8 3.96,16.92 | LED1.8 | R12.2 4.12,16.76 LED1.8
N$21
  Top 0.254: LED1.9 3.99,15.11 3.96,15.09 R13.2
N$22
  Top 0.254: LED1.24 28.02,15.11 28.04,15.09 R14.2
N$23
  Top 0.254: 4,13.37 3.96,13.41 | LED1.10 4,13.37 | R15.2 4.12,13.26 4,13.37
N$24
  Top 0.254: LED1.11 3.96,11.58 R16.2
N$25
  Top 0.254: 28.01,11.55 28.04,11.58 | 28.01,11.55 LED1.22 | R17.2 27.99,11.53 28.01,11.55
N$26
  Top 0.254: LED1.21 28.02,9.78 28.04,9.75 27.99,9.7 R18.2
N$27
  Top 0.254: 28.01,6.22 28.04,6.25 | 28.01,6.22 LED1.19 | R19.2 27.99,6.2 28.01,6.22
N$28
  Top 0.254: LED1.12 3.99,9.78 3.96,9.75 R20.2
N$29
  Top 0.254: 4,6.13 3.96,6.1 | LED1.14 4,6.13 | R21.2 4.12,6.25 4,6.13
N$30
  Top 0.254: 28.02,4.44 28.04,4.42 | 28.02,4.44 LED1.18 | R22.2 27.99,4.47 28.02,4.44
N$31
  Top 0.254: LED1.15 3.99,4.44 3.96,4.42 R23.2
N$32
  Top 0.254: 28,2.63 28.04,2.59 | 28,2.63 LED1.17 | R24.2 27.99,2.64 28,2.63
N$36
  Top 0.152: C9.1 6.55,93.12 6.53,93.09 U4.6
N$42  (via drill 0.41)
  Top 0.152: U2.9 19.01,16.05 18.75,16.31 v17.83,16.31
  Bottom 0.152: C5.1 17.07,16.46 17.22,16.31 v17.83,16.31
N$65  (via drill 0.41)
  Top 0.254: v20.57,59.13 20.57,59.59 20.83,59.84 U3.18
  Bottom 0.254: C1.1 20.64,59.2 v20.57,59.13
N$67
  Top 0.152: U3.29 26.33,65.34 28.5,67.51 28.5,69.34 29.17,70.02 29.2,70.02 | 29.2,70.02 C3.1 | 29.2,70.02 29.11,70.1 X1.3 29.11,70.71
N$68
  Top 0.152: U3.30 26.07,65.84 27.28,67.06 27.28,69.34 26.52,70.1 | C2.1 26.43,70.02 26.52,70.1 | X1.2 26.53,70.7 26.52,70.71 26.52,70.1
PGC  (via drill 0.41)
  Top 0.152: U3.42 15.46,70.93 v13.72,72.69 | v13.72,83.67 v26.06,83.67
  Bottom 0.152: v13.72,72.69 v13.72,83.67 | v26.06,83.67 26.06,99.52 27.43,100.89 JP2.5
PGD  (via drill 0.41)
  Top 0.152: U3.37 17.95,70.69 v18.29,71.02 | v18.29,82.91 v26.98,82.91
  Bottom 0.152: v18.29,71.02 v18.29,82.91 | v26.98,82.91 26.98,97.69 27.58,98.3 29.26,98.3 JP2.4
R1  (via drill 0.41)
  Top 0.152: U3.24 20.93,62.84 20.42,62.33 12.04,62.33 v11.73,62.03 | R1.1 15.14,27.64 v15.09,27.58
  Bottom 0.152: v11.73,62.03 10.36,62.03 8.69,60.35 8.69,35.97 14.63,30.02 14.63,28.04 v15.09,27.58
R2  (via drill 0.41)
  Top 0.152: U3.23 20.89,62.34 20.57,62.03 12.8,62.03 v11.73,60.96 | v15.09,26.52 14.94,26.67 8.84,26.67 7.92,25.76 R4.1 7.16,25.76
  Bottom 0.152: v11.73,60.96 9.75,60.96 8.99,60.2 8.99,36.12 15.85,29.26 15.85,27.28 v15.09,26.52
R3  (via drill 0.41)
  Top 0.152: U3.22 20.85,61.84 20.73,61.72 13.56,61.72 v11.73,59.89 | R7.1 16.2,23.98 v16.15,23.93
  Bottom 0.152: v11.73,59.89 9.3,57.45 9.3,36.27 16.15,29.41 v16.15,23.93
R4  (via drill 0.41)
  Top 0.152: U3.21 14.1,61.34 v13.26,60.5 | v16.92,19.36 8.53,19.36 7.92,18.75 R10.1
  Bottom 0.152: v13.26,60.5 9.6,56.69 9.6,36.42 16.92,29.11 v16.92,19.36
R5  (via drill 0.41)
  Top 0.152: U3.28 12.27,64.84 v12.19,64.77 | v14.48,14.33 8.69,14.33 7.92,15.09 R13.1
  Bottom 0.152: v12.19,64.77 8.08,60.66 8.08,35.66 14.02,29.72 14.02,14.78 v14.48,14.33
R6  (via drill 0.41)
  Top 0.152: U3.27 13.14,64.34 v12.95,64.16 | R16.1 7.92,11.58 8.53,12.19 v14.48,12.19
  Bottom 0.152: v12.95,64.16 11.58,62.79 10.67,62.79 8.38,60.5 8.38,35.81 14.33,29.87 14.33,15.39 15.24,14.48 15.24,14.17 14.48,13.41 v14.48,12.19
R7  (via drill 0.41)
  Top 0.152: U3.40 16.45,73 15.85,73.61 v7.32,73.61 | R19.1 13.46,6.2 v13.41,6.25
  Bottom 0.152: v7.32,73.61 7.47,73.46 7.47,35.36 13.41,29.41 v13.41,6.25
R8  (via drill 0.41)
  Top 0.152: U3.39 16.95,73.11 16.15,73.91 8.53,73.91 v8.08,74.37 | R22.1 14.22,4.47 v14.17,4.42
  Bottom 0.152: v14.17,4.42 14.17,6.4 13.72,6.86 13.72,29.57 7.77,35.51 7.77,73 8.08,73.3 v8.08,74.37
ROW1_H  (via drill 0.41)
  Top 0.305: U1.1 28.13,46.7 v28.35,46.94
  Bottom 0.305: v28.35,46.94 28.35,42.67 26.82,41.15 26.82,20.73 27.13,20.42 28.04,20.42 28.02,20.45 LED1.27
ROW1_L  (via drill 0.41)
  Top 0.152: v12.34,55.47 12.65,55.47 13.46,56.28 U3.3 | v12.34,41.15 v29.11,41.15 | R43.2 27.89,48.16 v27.58,47.85 27.48,47.75 U1.2
  Bottom 0.152: v12.34,41.15 v12.34,55.47 | v29.11,41.15 29.11,47.24 28.5,47.85 v27.58,47.85
ROW2_H  (via drill 0.41)
  Top 0.305: U1.4 26.83,42.99 v26.82,42.67
  Bottom 0.305: v26.82,42.67 26.06,41.91 26.06,20.42 26.82,19.66 26.82,17.37 27.28,16.92 27.89,16.92 27.92,16.89 LED1.25
ROW2_L  (via drill 0.41)
  Top 0.152: U3.17 26.76,59.34 v26.82,59.28 | U1.5 27.48,43.54 v27.58,43.43 | v26.82,48.62 R44.2
  Bottom 0.152: v26.82,59.28 26.82,51.82 v26.82,48.62 26.82,44.2 v27.58,43.43
ROW3_H  (via drill 0.41)
  Top 0.305: U6.1 25.24,46.7 v25.45,46.94
  Bottom 0.305: v25.45,46.94 25.45,19.81 26.06,19.2 26.06,16.61 26.82,15.85 26.82,13.72 27.13,13.41 27.89,13.41 27.97,13.33 LED1.23
ROW3_L  (via drill 0.41)
  Top 0.152: R45.2 24.99,48.16 v24.69,47.85 24.59,47.75 U6.2 | U3.16 19.95,55.48 21.64,53.8 22.4,53.8 23.62,52.58 v24.69,52.58
  Bottom 0.152: v24.69,47.85 v24.69,52.58
ROW4_H  (via drill 0.41)
  Top 0.305: U6.4 23.94,43.14 v23.93,42.67
  Bottom 0.305: v23.93,42.67 24.84,41.76 24.84,19.66 25.6,18.9 25.6,16.31 26.06,15.85 26.06,12.95 26.82,12.19 26.82,8.23 27.13,7.92 28.04,7.92 28,7.97 LED1.20
ROW4_L  (via drill 0.41)
  Top 0.152: U3.15 19.45,55.53 21.49,53.49 22.25,53.49 v23.93,51.82 | U6.5 24.59,43.54 v24.69,43.43 | v23.93,48.62 R46.2
  Bottom 0.152: v23.93,51.82 v23.93,48.62 23.93,44.2 v24.69,43.43
ROW5_H  (via drill 0.41)
  Top 0.305: 4,8.04 3.96,8.08 | LED1.13 4,8.04 | v25.76,7.92 4.12,7.92 4,8.04 | U7.1 22.34,46.54 v22.71,46.94
  Bottom 0.305: v22.71,46.94 22.71,42.22 24.23,40.69 24.23,19.36 24.99,18.59 24.99,16 25.45,15.54 25.45,12.65 25.76,12.34 v25.76,7.92
ROW5_L  (via drill 0.41)
  Top 0.152: U3.14 18.95,55.42 v21.79,52.58 | U7.2 21.69,47.75 v21.79,47.85 22.1,48.16 R47.2
  Bottom 0.152: v21.79,47.85 v21.79,52.58
ROW6_H  (via drill 0.41)
  Top 0.305: v23.47,24.69 5.64,24.69 4.88,23.93 4.12,23.93 4,24.04 | 4,24.04 3.96,24.08 | LED1.4 4,24.04 | U7.4 21.04,42.99 v21.03,42.67
  Bottom 0.305: v21.03,42.67 23.47,40.23 v23.47,24.69
ROW6_L  (via drill 0.41)
  Top 0.152: U3.13 18.45,54.39 v21.03,51.82 | U7.5 21.69,43.54 v21.79,43.43 | v21.03,48.62 R48.2
  Bottom 0.152: v21.03,51.82 v21.03,48.62 21.03,44.2 v21.79,43.43
ROW7_H  (via drill 0.41)
  Top 0.305: LED1.6 3.99,20.45 3.96,20.42 v23.47,20.42 | U8.1 19.45,46.57 v19.81,46.94
  Bottom 0.305: v19.81,46.94 19.81,42.52 22.86,39.47 22.86,25.45 22.55,25.15 22.55,24.38 23.47,23.47 v23.47,20.42
ROW7_L  (via drill 0.41)
  Top 0.152: U3.12 17.95,53.52 v18.9,52.58 | U8.2 18.8,47.75 v18.9,47.85 19.2,48.16 R49.2
  Bottom 0.152: v18.9,47.85 v18.9,52.58
ROW8_H  (via drill 0.41)
  Top 0.305: v26.98,3.5 7.77,3.5 7.01,2.74 3.96,2.74 4,2.71 LED1.16 | U8.4 18.15,42.68 v18.14,42.67
  Bottom 0.305: v18.14,42.67 22.25,38.56 22.25,25.6 21.95,25.3 21.95,24.08 22.71,23.32 22.71,19.96 24.38,18.29 24.38,15.7 24.84,15.24 24.84,12.34 24.99,12.19 24.99,7.47 26.98,5.49 v26.98,3.5
ROW8_L  (via drill 0.41)
  Top 0.152: U3.11 17.45,52.5 v18.14,51.82 | U8.5 18.8,43.54 v18.9,43.43 | v18.14,48.62 R50.2
  Bottom 0.152: v18.14,51.82 v18.14,48.62 18.14,44.2 v18.9,43.43
RX1  (via drill 0.41)
  Top 0.152: U3.32 21.91,67.17 22.25,67.51 v24.23,67.51 | JP3.3 30.18,63.55 30.02,63.7 v24.23,63.7
  Bottom 0.152: v24.23,67.51 v24.23,63.7
SCK1  (via drill 0.41)
  Top 0.152: v20.73,16.31 20.51,16.09 U2.6 | v14.48,74.68 v19.05,74.68 | U3.34 19.45,69.7 v19.05,70.1 | U5.6 3.83,49.25 5.79,51.21 12.5,51.21 13.11,50.6 v14.78,50.6
  Bottom 0.152: v20.73,16.31 20.73,17.22 18.59,19.36 18.59,34.9 14.78,38.71 v14.78,50.6 14.78,66.29 14.48,66.6 v14.48,74.68 | v19.05,74.68 v19.05,70.1
SDI1  (via drill 0.41)
  Top 0.152: U2.7 20.01,16.8 v19.81,17.07 | v16.46,48.01 v14.02,48.01 13.08,47.98 U5.2 | U3.35 18.95,67.91 19.2,67.67 v19.2,66.9
  Bottom 0.152: v19.81,17.07 18.29,18.59 18.29,34.75 14.02,39.01 v14.02,48.01 | v19.2,66.9 19.2,66.29 17.98,65.08 17.98,58.83 16.92,57.76 16.92,48.46 v16.46,48.01
SDO1  (via drill 0.41)
  Top 0.152: U2.8 19.51,16.15 v18.59,17.07 | U3.36 18.45,67.53 v18.44,67.51 | U5.5 4.65,50.52 5.64,51.51 v13.26,51.51 v15.54,51.51
  Bottom 0.152: v18.59,17.07 17.98,17.68 17.98,34.59 13.26,39.32 v13.26,51.51 | v18.44,67.51 18.44,65.99 17.68,65.23 17.68,58.98 15.09,56.39 15.09,51.97 v15.54,51.51
SW1  (via drill 0.41)
  Top 0.152: U3.46 13.46,69.91 12.34,71.02 9.6,71.02 8.84,71.78 v3.5,71.78 | SW1.2 3.54,78.75 3.5,78.79 3.42,78.7 R28.2
  Bottom 0.152: v3.5,71.78 3.5,76.2 3.96,76.66 3.96,78.33 3.56,78.74 SW1.2
SW2  (via drill 0.41)
  Top 0.152: U3.45 13.96,69.86 12.04,71.78 v10.06,71.78 | v10.06,77.72 R29.2 11.97,78.7 12.04,78.64 12.08,78.67 SW2.2
  Bottom 0.152: v10.06,71.78 v10.06,77.72
SW3  (via drill 0.41)
  Top 0.152: U3.44 14.46,69.82 v11.73,72.54 | v11.73,77.11 16.92,77.11 18.49,78.69 R30.2 20.33,78.7 20.42,78.79 20.46,78.75 SW3.2
  Bottom 0.152: v11.73,72.54 v11.73,77.11
TX1  (via drill 0.41)
  Top 0.152: U3.31 23.21,66.34 v23.47,66.6 | JP3.2 30.12,61.01 30.18,60.96 29.41,60.96 27.89,62.48 v23.47,62.48
  Bottom 0.152: v23.47,62.48 v23.47,66.6
VBATT  (via drill 0.41)
  Top 0.152: R26.2 v1.52,76.96
  Top 0.254: C10.1 5.03,90.07 5.08,90.02 U4.9 6.53,90.5 6.55,90.53 U4.8 | C10.1 4.93,89.2 v4.88,89.15
  Top 0.305: JP1.2 1.98,90.07 2.07,89.98 C10.1 | 13.93,95.64 C14.1 | 13.93,95.64 14.02,95.56 20.57,95.56 20.59,95.54 L2.2 | 13.93,95.64 13.93,95.62 13.87,95.56 v5.64,95.56
  Top 0.406: 20.27,99.97 20.23,99.94 U9.6 20.19,98.68 20.27,98.6 C12.1 20.36,95.92 20.59,95.69 L2.2 20.69,95.52 20.73,95.56 | C14.1 13.97,96.88 14.02,96.93 13.83,97.11 U10.1 13.83,99.63 14.17,99.97 15.39,99.97 15.7,99.67 15.7,98.91 15.73,98.87 U10.3
  Bottom 0.152: JP1.2 1.98,77.42 v1.52,76.96
  Bottom 0.305: v4.88,89.15 5.64,89.92 v5.64,95.56
VDD  (via drill 0.41)
  Bottom 0.254: C4.1 23.42,58.57 v23.47,58.52
  Bottom 0.305: v21.79,1.83 v21.79,11.43
  Bottom 0.406: C6.1 16.37,11.8 v16.31,11.73 | v8.84,63.09 v8.84,68.89
  pour Top (isolate 0.254, rank 2): 1.27,0 arc-90 0,1.27 0,104.95 arc-90 1.27,106.22 30.73,106.22 arc-90 32,104.95 32,1.27 arc-90 30.73,0
VLED  (via drill 0.41)
  Top 0.406: U9.5 21.18,100.89 21.49,101.19 21.49,102.26 20.57,103.17 | 20.57,103.17 C13.1 | 20.57,103.17 v20.57,104.24 20.12,104.7 18.59,104.7 R39.1
  Bottom 0.406: v20.57,104.24 20.57,94.18 22.55,92.35 22.55,71.02 25.76,67.67 25.76,48.16 v26.06,47.85
  pour Top (isolate 0.254): 17.22,51.05 17.22,43.13 15.54,43.13 15.54,41.61 29.26,41.61 29.26,51.05
VLED_EN  (via drill 0.41)
  Top 0.152: 23.66,101.84 U9.3 23.81,101.84 v23.93,101.96 23.93,104.55 R31.2 | U3.43 14.96,67.49 v15.54,66.9 | v15.24,75.44 v23.62,75.44
  Bottom 0.152: v15.54,66.9 14.78,67.67 14.78,73.76 15.24,74.22 v15.24,75.44 | v23.62,75.44 23.62,98.75 24.69,99.82 24.69,101.19 v23.93,101.96
VUSB  (via drill 0.41)
  Top 0.254: v9.6,93.57 10.36,92.81 10.36,90.53 | 10.36,90.07 10.36,90.53 | 10.36,90.53 U4.3 | U4.2 10.31,90.02 10.36,90.07 | U4.10 6.53,88.42 6.86,88.09 9.91,88.09 10.36,88.54 10.36,90.07
  Top 0.406: X3.1 7.7,98.53 v9.6,100.43 | C7.1 9.54,93.66 v9.6,93.57
  Bottom 0.406: v9.6,93.57 v9.6,100.43

### Text on the board
Document: ICSP | - | + | UART | Nelson | Anders | (0,0)